# Altium schematic sheet 3-FIFO.SchDoc
size A2; SheetNumber: 3; SheetTotal: 5
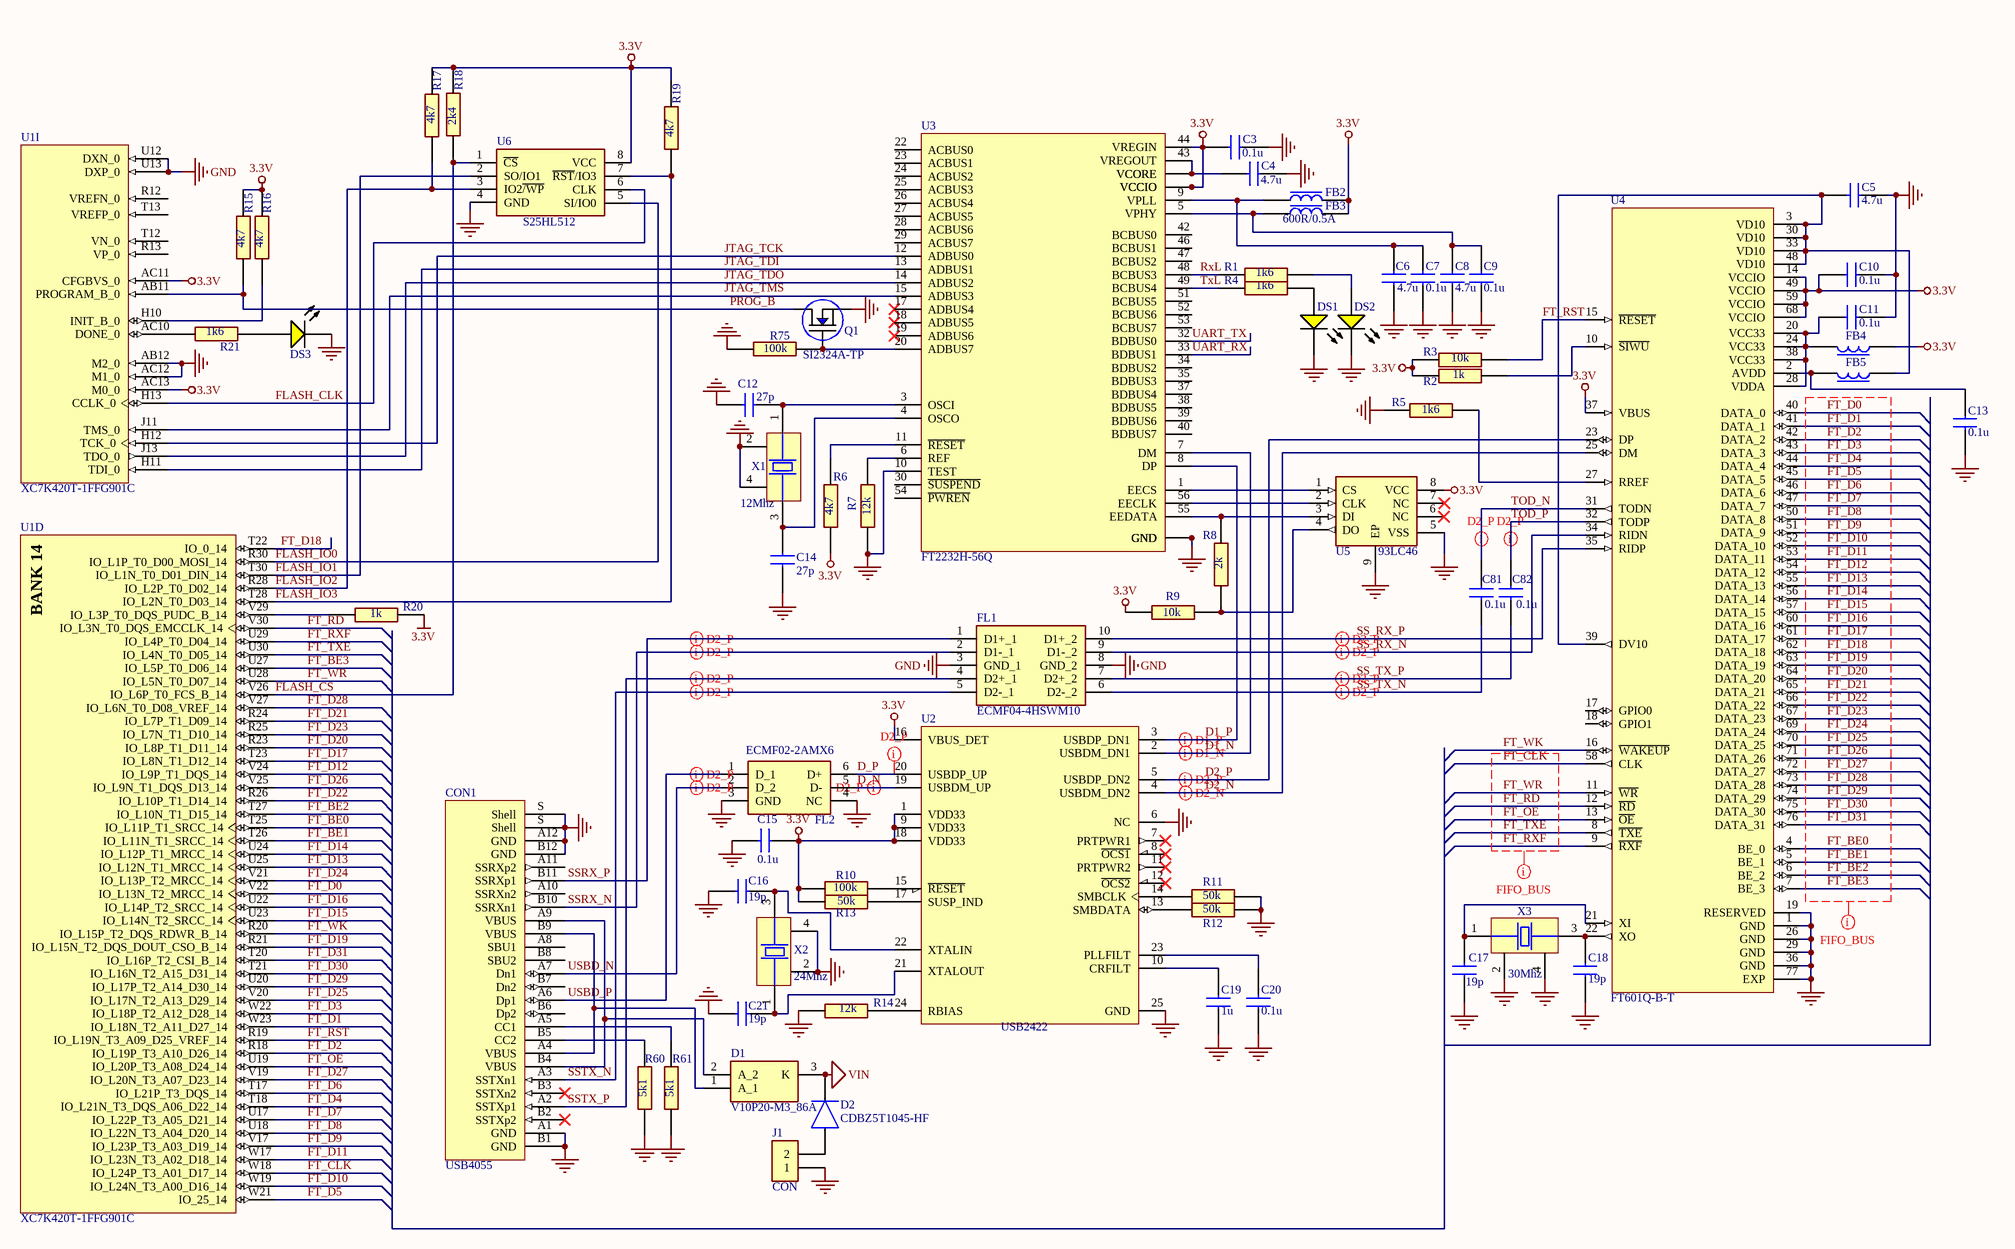
[diagram p0: 3-FIFO.SchDoc]

## Parts
C3  0.1u  [SMD0402]
C4  4.7u  [SMD0402]
C5  4.7u  [SMD0402]
C6  4.7u  [SMD0402]
C7  0.1u  [SMD0402]
C8  4.7u  [SMD0402]
C9  0.1u  [SMD0402]
C10  0.1u  [SMD0402]
C11  0.1u  [SMD0402]
C12  27p  [SMD0402]
C13  0.1u  [SMD0402]
C14  27p  [SMD0402]
C15  0.1u  [SMD0402]
C16  19p  [SMD0402]
C17  19p  [SMD0402]
C18  19p  [SMD0402]
C19  1u  [SMD0402]
C20  0.1u  [SMD0402]
C21  19p  [SMD0402]
C81  0.1u  [SMD0402]
C82  0.1u  [SMD0402]
CON1  USB4055  [DX07S024JA2R1200]
D1  V10P20-M3_86A  [V10P20M386A]
D2  CDBZ5T1045-HF  [DIOM8060X543N]
DS1  LED 0603  [LED0603]  (value not drawn)
DS2  LED 0603  [LED0603]  (value not drawn)
DS3  LED 0603  [LED0603]  (value not drawn)
FB2  600R/0.5A  [SMD0402]  (value not drawn)
FB3  600R/0.5A  [SMD0402]
FB4  600R/0.5A  [SMD0402]  (value not drawn)
FB5  600R/0.5A  [SMD0402]  (value not drawn)
FL1  ECMF04-4HSWM10  [SON50P135X260X55-10N-D]
FL2  ECMF02-2AMX6  [SON50P150X170X55-6N-D]
J1  CON  [TB00650802BE]
Q1  SI2324A-TP  [SI2305TP]
R1  1k6  [SMD0402]
R2  1k  [SMD0402]
R3  10k  [SMD0402]
R4  1k6  [SMD0402]
R5  1k6  [SMD0402]
R6  4k7  [SMD0402]
R7  12k  [SMD0402]
R8  2k  [SMD0402]
R9  10k  [SMD0402]
R10  100k  [SMD0402]
R11  50k  [SMD0402]
R12  50k  [SMD0402]
R13  50k  [SMD0402]
R14  12k  [SMD0402]
R15  4k7  [SMD0402]
R16  4k7  [SMD0402]
R17  4k7  [SMD0402]
R18  2k4  [SMD0402]
R19  4k7  [SMD0402]
R20  1k  [SMD0402]
R21  1k6  [SMD0402]
R60  5k1  [SMD0402]
R61  5k1  [SMD0402]
R75  100k  [SMD0402]
U1  XC7K420T-1FFG901C  [FFG901]  (parts D,I of 16)
U2  USB2422  [QFN-MJ24]
U3  FT2232H-56Q  [QFN50P800X800X100-57N-D]
U4  FT601Q-B-T  [*QFN40P900X900X100-77N]
U5  93LC46  [*SON50P200X300X100-9N]
U6  S25HL512  [SON127P800X600X80-9N-D]
X1  12Mhz  [CRYSTAL2520]
X2  24Mhz  [CRYSTAL1210]
X3  30Mhz  [CRYSTAL1210]

## Nets
3.3V: C3.2 C10.2 C15.1 FB2.2 FB3.2 FB4.1 R2.2 R3.1 R6.1 R9.2 R10.1 R13.1 R15.2 R16.2 R17.2 R18.2 R19.2 R20.2 U1.AC11(CFGBVS_0) U1.AC13(M0_0) U2.1(VDD33) U2.9(VDD33) U2.16(VBUS_DET) U2.18(VDD33) U3.16(VCCIO) U3.36(VCCIO) U3.44(VREGIN) U3.50(VCCIO) U4.14(VCCIO) U4.37(VBUS) U4.49(VCCIO) U4.59(VCCIO) U4.68(VCCIO) U5.8(VCC) U6.8(VCC)
GND: C3.1 C4.1 C5.1 C6.1 C7.1 C8.1 C9.1 C10.1 C11.1 C12.2 C13.2 C14.1 C15.2 C16.1 C17.2 C18.2 C19.2 C20.2 C21.1 CON1.A1(GND) CON1.A12(GND) CON1.B1(GND) CON1.B12(GND) CON1.S(Shell) DS1.2(K) DS2.2(K) DS3.2(K) FL1.3(GND_1) FL1.8(GND_2) FL2.3(GND) FL2.4(NC) J1.1 Q1.2(S) R5.2 R7.1 R11.2 R12.2 R14.1 R60.1 R61.1 R75.2 U1.AB12(M2_0) U1.AC12(M1_0) U1.U12(DXN_0) U1.U13(DXP_0) U2.6(NC) U2.25(GND) U3.10(TEST) U3.21(GND) U3.41(GND) U3.45(GND) U3.57(GND) U4.1(GND) U4.19(RESERVED) U4.26(GND) U4.29(GND) U4.36(GND) U4.77(EXP) U5.5(VSS) U5.9(EP) U6.4(GND) X1.2(GND) X1.4(GND) X2.2(GND) X2.4(GND) X3.2(GND) X3.4(GND)
VIN: D1.3(K) D2.1(K)
D1_N: U2.2(USBDM_DN1) U3.7(DM)
D1_P: U2.3(USBDP_DN1) U3.8(DP)
D2_N: U2.4(USBDM_DN2) U4.25(DM)
D2_P: U2.5(USBDP_DN2) U4.23(DP)
D_N: FL2.5(D-) U2.19(USBDM_UP)
D_P: FL2.6(D+) U2.20(USBDP_UP)
FLASH_CLK: U1.H13(CCLK_0) U6.6(CLK)
FLASH_CS: R18.1 U1.V26(IO_L6P_T0_FCS_B_14) U6.1(~{CS})
FLASH_IO0: U1.R30(IO_L1P_T0_D00_MOSI_14) U6.5(SI/IO0)
FLASH_IO1: U1.T30(IO_L1N_T0_D01_DIN_14) U6.2(SO/IO1)
FLASH_IO2: R17.1 U1.R28(IO_L2P_T0_D02_14) U6.3(IO2~{/WP})
FLASH_IO3: R19.1 U1.T28(IO_L2N_T0_D03_14) U6.7(~{RST}/IO3)
FT_BE0: U1.T25(IO_L11P_T1_SRCC_14) U4.4(BE_0)
FT_BE1: U1.T26(IO_L11N_T1_SRCC_14) U4.5(BE_1)
FT_BE2: U1.T27(IO_L10N_T1_D15_14) U4.6(BE_2)
FT_BE3: U1.U27(IO_L5P_T0_D06_14) U4.7(BE_3)
FT_CLK: U1.W18(IO_L24P_T3_A01_D17_14) U4.58(CLK)
FT_D0: U1.V22(IO_L13N_T2_MRCC_14) U4.40(DATA_0)
FT_D1: U1.W23(IO_L18N_T2_A11_D27_14) U4.41(DATA_1)
FT_D2: U1.R18(IO_L19P_T3_A10_D26_14) U4.42(DATA_2)
FT_D3: U1.W22(IO_L18P_T2_A12_D28_14) U4.43(DATA_3)
FT_D4: U1.T18(IO_L21N_T3_DQS_A06_D22_14) U4.44(DATA_4)
FT_D5: U1.W21(IO_25_14) U4.45(DATA_5)
FT_D6: U1.T17(IO_L21P_T3_DQS_14) U4.46(DATA_6)
FT_D7: U1.U17(IO_L22P_T3_A05_D21_14) U4.47(DATA_7)
FT_D8: U1.U18(IO_L22N_T3_A04_D20_14) U4.50(DATA_8)
FT_D9: U1.V17(IO_L23P_T3_A03_D19_14) U4.51(DATA_9)
FT_D10: U1.W19(IO_L24N_T3_A00_D16_14) U4.52(DATA_10)
FT_D11: U1.W17(IO_L23N_T3_A02_D18_14) U4.53(DATA_11)
FT_D12: U1.V24(IO_L9P_T1_DQS_14) U4.54(DATA_12)
FT_D13: U1.U25(IO_L12N_T1_MRCC_14) U4.55(DATA_13)
FT_D14: U1.U24(IO_L12P_T1_MRCC_14) U4.56(DATA_14)
FT_D15: U1.U23(IO_L14N_T2_SRCC_14) U4.57(DATA_15)
FT_D16: U1.U22(IO_L14P_T2_SRCC_14) U4.60(DATA_16)
FT_D17: U1.T23(IO_L8N_T1_D12_14) U4.61(DATA_17)
FT_D18: U1.T22(IO_0_14) U4.62(DATA_18)
FT_D19: U1.R21(IO_L15N_T2_DQS_DOUT_CSO_B_14) U4.63(DATA_19)
FT_D20: U1.R23(IO_L8P_T1_D11_14) U4.64(DATA_20)
FT_D21: U1.R24(IO_L7P_T1_D09_14) U4.65(DATA_21)
FT_D22: U1.R26(IO_L10P_T1_D14_14) U4.66(DATA_22)
FT_D23: U1.R25(IO_L7N_T1_D10_14) U4.67(DATA_23)
FT_D24: U1.V21(IO_L13P_T2_MRCC_14) U4.69(DATA_24)
FT_D25: U1.V20(IO_L17N_T2_A13_D29_14) U4.70(DATA_25)
FT_D26: U1.V25(IO_L9N_T1_DQS_D13_14) U4.71(DATA_26)
FT_D27: U1.V19(IO_L20N_T3_A07_D23_14) U4.72(DATA_27)
FT_D28: U1.V27(IO_L6N_T0_D08_VREF_14) U4.73(DATA_28)
FT_D29: U1.U20(IO_L17P_T2_A14_D30_14) U4.74(DATA_29)
FT_D30: U1.T21(IO_L16N_T2_A15_D31_14) U4.75(DATA_30)
FT_D31: U1.T20(IO_L16P_T2_CSI_B_14) U4.76(DATA_31)
FT_OE: U1.U19(IO_L20P_T3_A08_D24_14) U4.13(~{OE})
FT_RD: U1.V30(IO_L3N_T0_DQS_EMCCLK_14) U4.12(~{RD})
FT_RST: R3.2 U1.R19(IO_L19N_T3_A09_D25_VREF_14) U4.15(~{RESET})
FT_RXF: U1.U29(IO_L4P_T0_D04_14) U4.9(~{RXF})
FT_TXE: U1.U30(IO_L4N_T0_D05_14) U4.8(~{TXE})
FT_WK: U1.R20(IO_L15P_T2_DQS_RDWR_B_14) U4.16(~{WAKEUP})
FT_WR: U1.U28(IO_L5N_T0_D07_14) U4.11(~{WR})
JTAG_TCK: U1.H12(TCK_0) U3.12(ADBUS0)
JTAG_TDI: U1.H11(TDI_0) U3.13(ADBUS1)
JTAG_TDO: U1.J13(TDO_0) U3.14(ADBUS2)
JTAG_TMS: U1.J11(TMS_0) U3.15(ADBUS3)
PROG_B: Q1.3(D) R15.1 U1.AB11(PROGRAM_B_0)
RxL: R1.2 U3.48(BCBUS3)
SS_RX_N: FL1.9(D1-_2) U4.34(RIDN)
SS_RX_P: FL1.10(D1+_2) U4.35(RIDP)
SS_TX_N: C81.2 FL1.6(D2-_2)
SS_TX_P: C82.2 FL1.7(D2+_2)
SSRX_N: CON1.B10(SSRXn1) FL1.2(D1-_1)
SSRX_P: CON1.B11(SSRXp1) FL1.1(D1+_1)
SSTX_N: CON1.A3(SSTXn1) FL1.5(D2-_1)
SSTX_P: CON1.A2(SSTXp1) FL1.4(D2+_1)
TOD_N: C81.1 U4.31(TODN)
TOD_P: C82.1 U4.32(TODP)
TxL: R4.2 U3.49(BCBUS4)
UART_RX: U3.33(BDBUS1)
UART_TX: U3.32(BDBUS0)
USBD_N: CON1.A7(Dn1) FL2.2(D_2)
USBD_P: CON1.A6(Dp1) FL2.1(D_1)
NetC4_2: C4.2 U3.2(VCORE) U3.31(VCORE) U3.43(VREGOUT)
NetC5_2: C5.2 FB5.1 U4.3(VD10) U4.30(VD10) U4.33(VD10) U4.39(DV10) U4.48(VD10)
NetC6_2: C6.2 C7.2 FB2.1 U3.9(VPLL)
NetC8_2: C8.2 C9.2 FB3.1 U3.5(VPHY)
NetC11_2: C11.2 FB4.2 U4.20(VCC33) U4.24(VCC33) U4.28(VDDA) U4.38(VCC33)
NetC12_1: C12.1 U3.3(OSCI) X1.1(X1)
NetC13_1: C13.1 FB5.2 U4.2(AVDD)
NetC14_2: C14.2 U3.4(OSCO) X1.3(X2)
NetC16_2: C16.2 U2.22(XTALIN) X2.3(X2)
NetC17_1: C17.1 U4.21(XI) X3.1(X1)
NetC18_1: C18.1 U4.22(XO) X3.3(X2)
NetC19_1: C19.1 U2.10(CRFILT)
NetC20_1: C20.1 U2.23(PLLFILT)
NetC21_2: C21.2 U2.21(XTALOUT) X2.1(X1)
NetCON1_A4: CON1.A4(VBUS) CON1.B9(VBUS) D1.1(A_1)
NetCON1_A5: CON1.A5(CC1) R61.2
NetCON1_A9: CON1.A9(VBUS) CON1.B4(VBUS) D1.2(A_2)
NetCON1_B5: CON1.B5(CC2) R60.2
NetD2_2: D2.2(A) J1.2
NetDS1_1: DS1.1(A) R4.1
NetDS2_1: DS2.1(A) R1.1
NetDS3_1: DS3.1(A) R21.1
NetQ1_1: Q1.1(G) R75.1 U3.20(ADBUS7)
NetR2_1: R2.1 U4.10(~{SIWU})
NetR5_1: R5.1 U4.27(RREF)
NetR6_2: R6.2 U3.11(~{RESET})
NetR7_2: R7.2 U3.6(REF)
NetR8_1: R8.1 U3.55(EEDATA) U5.3(DI)
NetR8_2: R8.2 R9.1 U5.4(DO)
NetR10_2: R10.2 U2.15(~{RESET})
NetR11_1: R11.1 U2.14(SMBCLK)
NetR12_1: R12.1 U2.13(SMBDATA)
NetR13_2: R13.2 U2.17(SUSP_IND)
NetR14_2: R14.2 U2.24(RBIAS)
NetR16_1: R16.1 U1.H10(INIT_B_0)
NetR20_1: R20.1 U1.V29(IO_L3P_T0_DQS_PUDC_B_14)
NetR21_2: R21.2 U1.AC10(DONE_0)
NetU3_1: U3.1(EECS) U5.1(CS)
NetU3_56: U3.56(EECLK) U5.2(CLK)

Not connected (* = marked no-connect by the designer): CON1 A8(SBU1) A10(SSRXn2) A11(SSRXp2) B2(SSTXp2)* B3(SSTXn2)* B6(Dp2) B7(Dn2) B8(SBU2); U1 R12(VREFN_0) R13(VP_0) T12(VN_0) T13(VREFP_0); U2 7(PRTPWR1)* 8(~{OCS1})* 11(PRTPWR2)* 12(~{OCS2})*; U3 17(ADBUS4)* 18(ADBUS5)* 19(ADBUS6)* 22(ACBUS0) 23(ACBUS1) 24(ACBUS2) 25(ACBUS3) 26(ACBUS4) 27(ACBUS5) 28(ACBUS6) 29(ACBUS7) 30(~{SUSPEND}) 34(BDBUS2) 35(BDBUS3) 37(BDBUS4) 38(BDBUS5) 39(BDBUS6) 40(BDBUS7) 42(BCBUS0) 46(BCBUS1) 47(BCBUS2) 51(BCBUS5) 52(BCBUS6) 53(BCBUS7) 54(~{PWREN}); U4 17(GPIO0) 18(GPIO1); U5 6(NC)* 7(NC)*

## Layout directives
differential pair: D1_N, D1_P, D2_N, D2_P, D_N, D_P, SS_RX_N, SS_RX_P, SS_TX_N, SS_TX_P, SSRX_N, SSRX_P, SSTX_N, SSTX_P, TOD_N, TOD_P, USBD_N, USBD_P
net class FIFO_BUS: FT_BE0, FT_BE1, FT_BE2, FT_BE3, FT_CLK, FT_D0, FT_D1, FT_D2, FT_D3, FT_D4, FT_D5, FT_D6, FT_D7, FT_D8, FT_D9, FT_D10, FT_D11, FT_D12, FT_D13, FT_D14, FT_D15, FT_D16, FT_D17, FT_D18, FT_D19, FT_D20, FT_D21, FT_D22, FT_D23, FT_D24, FT_D25, FT_D26, FT_D27, FT_D28, FT_D29, FT_D30, FT_D31, FT_OE, FT_RD, FT_RXF, FT_TXE, FT_WR

## Notes on the sheet
- (in symbol XC7K420T-1FFG901C, part D) BANK 14

## Library data of the parts
C3-C18 C20 C21 C81 C82 = CAP 0402: Capacitor
C19 = CAP 0201: Capacitor
CON1 = USB-3.0-TYPE-C-3.0: Micro USB Receptacle, Type C, Hybrid Type, PCB Top Mount
D1 = V10P20-M3_86A: Schottky Diode; Manufacturer_Name: Vishay; Manufacturer_Part_Number: V10P20-M3/86A; Datasheet Link: https://componentsearchengine.com/Datasheets/1/V10P20-M3_86A.pdf; Height: 1.2mm; Mouser Part Number: 78-V10P20-M3/86A; Mouser Price/Stock: http://www.mouser.com/Search/ProductDetail.aspx?qs=ZB8tH5z5N7ZN%2fq6ksuxZBw%3d%3d
D2 = SK106-TP: Diode; Manufacturer_Name: Micro Commercial Components (MCC); Datasheet Link: http://www.mccsemi.com/up_pdf/SK102-SK1010(HSMC).PDF; Height: 5.43mm; Manufacturer_Part_Number: SK106-TP; Mouser Part Number: 833-SK106-TP; Mouser Price/Stock: https://www.mouser.co.uk/ProductDetail/Micro-Commercial-Components-MCC/SK106-TP?qs=SdqRYZZ9IxAPDINIgRyYqg%3D%3D; Arrow Part Number: SK106-TP; Arrow Price/Stock: https://www.arrow.com/en/products/sk106-tp/micro-commercial-components
DS1-DS3 = LED 0603: LED 0603 SMD
FB2-FB5 = FERRITE 0402: Ferrite Bead
FL1 = ECMF04-4HSWM10: Filter; Manufacturer_Name: STMicroelectronics; Datasheet Link: https://www.st.com/resource/en/datasheet/ecmf04-4hswm10.pdf; Height: 0.55mm; Manufacturer_Part_Number: ECMF04-4HSWM10; Arrow Part Number: ECMF04-4HSWM10; Arrow Price/Stock: https://www.arrow.com/en/products/ecmf04-4hswm10/stmicroelectronics; Mouser Part Number: 511-ECMF04-4HSWM10; Mouser Price/Stock: https://www.mouser.co.uk/ProductDetail/STMicroelectronics/ECMF04-4HSWM10?qs=9MuLHSklicqPUQRNi%252Bx1Sg%3D%3D
FL2 = ECMF02-2AMX6: Integrated Circuit; Manufacturer_Name: STMicroelectronics; Datasheet Link: http://www.st.com/content/ccc/resource/technical/document/datasheet/3a/28/cf/d0/31/63/48/8c/CD00282307.pdf/files/CD00282307.pdf/jcr:content/translations/en.CD00282307.pdf; Height: 0.55mm; Manufacturer_Part_Number: ECMF02-2AMX6; Arrow Part Number: ECMF02-2AMX6; Arrow Price/Stock: https://www.arrow.com/en/products/ecmf02-2amx6/stmicroelectronics; Mouser Part Number: 511-ECMF02-2AMX6; Mouser Price/Stock: https://www.mouser.co.uk/ProductDetail/STMicroelectronics/ECMF02-2AMX6?qs=raAh8RbVwI65u5gmT42%2Flg%3D%3D
J1 = TB006-508-02BE: Connector; Manufacturer_Name: CUI Devices; Datasheet Link: https://www.mouser.com/datasheet/2/670/tb006-508-1550645.pdf; Height: 10.4mm; Manufacturer_Part_Number: TB006-508-02BE; Mouser Part Number: 490-TB006-508-02BE; Mouser Price/Stock: https://www.mouser.co.uk/ProductDetail/CUI-Devices/TB006-508-02BE/?qs=vLWxofP3U2wEdOVV%2FaT04w%3D%3D; Arrow Part Number: TB006-508-02BE; Arrow Price/Stock: https://www.arrow.com/en/products/tb006-508-02be/cui-devices
Q1 = SI2324A-TP: MOSFET (N-Channel); Manufacturer_Name: Micro Commercial Components (MCC); Datasheet Link: https://www.mccsemi.com/pdf/Products/SI2324A(SOT-23)-A.pdf; Manufacturer_Part_Number: SI2324A-TP; Mouser Part Number: 833-SI2324A-TP; Mouser Price/Stock: https://www.mouser.com/Search/Refine.aspx?Keyword=833-SI2324A-TP; Arrow Part Number: SI2324A-TP; Arrow Price/Stock: https://www.arrow.com/en/products/si2324a-tp/micro-commercial-components
R1-R21 R60 R61 R75 = RES 0402: Resistor
U1 = XC7K420T-1FFG901C: Kintex-7 FPGA, 400 User I/Os, 28 GTX, 900-Ball BGA, Speed Grade 1, Commercial Grade, Pb-Free; Manufacturer: Xilinx; GTX: 28; SelectIO HP: 0; SelectIO HR: 380; Speed Grade: -1; DatasheetVersion: v1.12; PackageVersion: Rev 1.8; PackageReference: FFG901; PackageDescription: Flip-Chip BGA, Body 31 x 31 mm, 1.0 mm Pitch; Generic Part Number: XC7K420T; RoHS: Pb-Free; Mounting Technology: Surface Mount; Code_JEDEC: MS-034-AAN-1; PartNumber: XC7K420T-1FFG901C; ComponentLink1Description: Datasheet; ComponentLink1URL: http://www.xilinx.com/support/documentation/data_sheets/ds180_7Series_Overview.pdf; ComponentLink2Description: Package Specification; ComponentLink2URL: http://www.xilinx.com/support/documentation/user_guides/ug475_7Series_Pkg_Pinout.pdf
U2 = USB2422: Microchip Technology USB2422/MJ, USB Controller, USB 2.0, 3.3 V, 24-Pin SQFN; Operating Temperature: 0.00 °C (min); Packaging: Tray
U3 = FT2232H-56Q: Integrated Circuit
U4 = FT601Q-B-T: USB Bridge, USB to FIFO USB 3.0 FIFO Interface 76-QFN _9x9_; MF: FTDI, Future; Package: QFN-76 FTDI; Price: None; Availability: Unavailable; MP: FT601Q-B-T; SnapEDA_Link: https://www.snapeda.com/parts/FT601Q-B-T/FTDI%2C%20Future%20Technology%20Devices%20International%20Ltd/view-part/774389/?ref=snap; Value: *
U5 = 93LC46BT-I_MC
U6 = S25HL512: 512Mbit 3.3V Uniform Sector Dual and Quad Serial Flash
X1 = CRYSTAL2520: Crystal 2.5mm x 2.0mm
X2 X3 = CRYSTAL1210: Crystal 1.2mm x 1.0mm